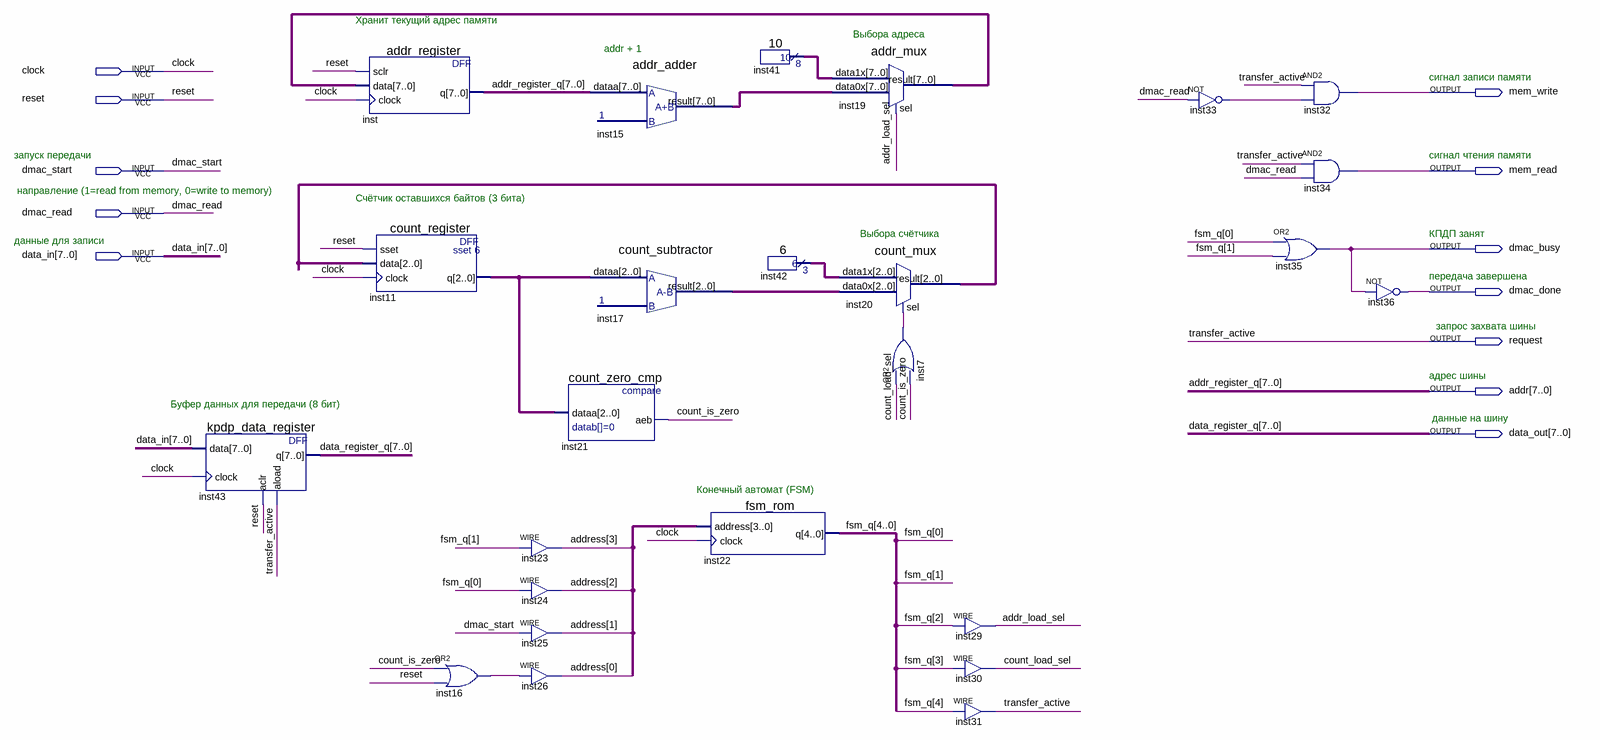
[diagram p0: schematic sheet]
// Quartus schematic dmac_controller.bdf as structural Verilog: 25 symbols, 12 pins
module dmac_controller (
  input  clock,
  input  reset,
  input  dmac_start,
  input  dmac_read,
  input  [7:0] data_in,
  output mem_write,
  output mem_read,
  output dmac_busy,
  output dmac_done,
  output request,
  output [7:0] addr,
  output [7:0] data_out
);

  wire addr_load_sel, count_is_zero, count_load_sel, inst7_out, inst16_out, inst33_out;
  wire [2:0] inst11_q, inst17_result, inst20_result, inst42_result;
  wire [3:0] address;
  wire [4:0] fsm_q;
  wire [7:0] inst15_result, inst19_result, inst41_result;

  kpdp_data_register inst43 (.data(data_in), .clock(clock), .aclr(reset), .aload(request), .q(data_out));
  addr_register inst (.sclr(reset), .data(inst19_result), .clock(clock), .q(addr));
  count_register inst11 (.sset(reset), .data(inst20_result), .clock(clock), .q(inst11_q));
  or inst16 (inst16_out, count_is_zero, reset);
  assign address[3] = fsm_q[1];  // WIRE inst23
  assign address[2] = fsm_q[0];  // WIRE inst24
  assign address[1] = dmac_start;  // WIRE inst25
  assign address[0] = inst16_out;  // WIRE inst26
  count_zero_cmp inst21 (.dataa(inst11_q), .aeb(count_is_zero));
  addr_adder inst15 (.dataa(addr), .result(inst15_result));
  count_subtractor inst17 (.dataa(inst11_q), .result(inst17_result));
  fsm_rom inst22 (.address(address), .clock(clock), .q(fsm_q));
  \10  inst41 (.result(inst41_result));
  \6  inst42 (.result(inst42_result));
  addr_mux inst19 (.data1x(inst41_result), .data0x(inst15_result), .sel(addr_load_sel), .result(inst19_result));
  count_mux inst20 (.data1x(inst42_result), .data0x(inst17_result), .sel(inst7_out), .result(inst20_result));
  or inst7 (inst7_out, count_load_sel, count_is_zero);
  assign addr_load_sel = fsm_q[2];  // WIRE inst29
  assign count_load_sel = fsm_q[3];  // WIRE inst30
  assign request = fsm_q[4];  // WIRE inst31
  not inst33 (inst33_out, dmac_read);
  and inst32 (mem_write, request, inst33_out);
  and inst34 (mem_read, request, dmac_read);
  or inst35 (dmac_busy, fsm_q[0], fsm_q[1]);
  not inst36 (dmac_done, dmac_busy);

  // Other names for the same wires on the sheet: addr_register_q[7:0] = addr; data_register_q[7:0] = data_out;
  //   transfer_active = request

  // Notes on the sheet:
  //   Хранит текущий адрес памяти
  //   Выбора адреса
  //   addr + 1
  //   сигнал записи памяти
  //   запуск передачи
  //   сигнал чтения памяти
  //    направление (1=read from memory, 0=write to memory)
  //   Счётчик оставшихся байтов (3 бита)
  //   Выбора счётчика
  //   КПДП занят
  //   данные для записи
  //   передача завершена
  //   запрос захвата шины
  //   адрес шины
  //   Буфер данных для передачи (8 бит)
  //    данные на шину
  //   Конечный автомат (FSM)
endmodule
